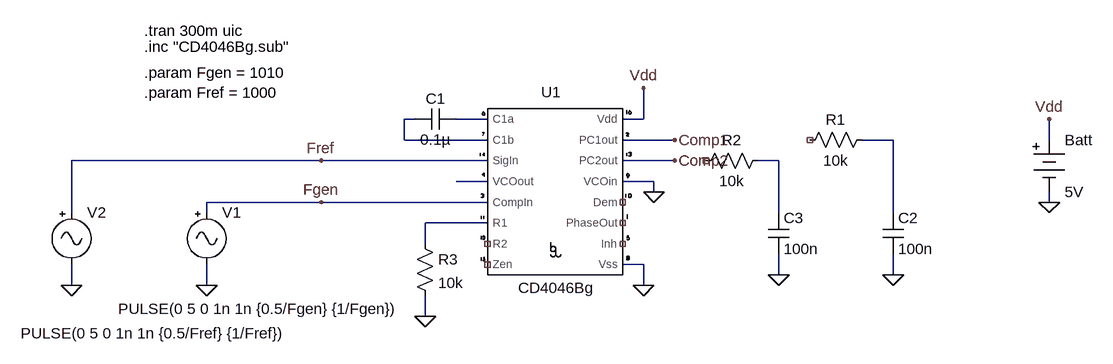
[diagram p0: schematic comparators.asc]
comparators.asc, the LTspice schematic file:
Version 4
SHEET 1 1052 680
WIRE 0 64 -16 64
WIRE 112 64 64 64
WIRE 352 64 352 16
WIRE 352 64 320 64
WIRE -16 96 -16 64
WIRE 112 96 -16 96
WIRE 400 96 320 96
WIRE 736 96 688 96
WIRE 976 96 976 64
WIRE -144 128 -528 128
WIRE 112 128 -144 128
WIRE 400 128 320 128
WIRE 560 128 528 128
WIRE 112 160 64 160
WIRE 368 160 320 160
WIRE 368 176 368 160
WIRE -144 192 -320 192
WIRE 112 192 -144 192
WIRE 976 192 976 176
WIRE -528 208 -528 128
WIRE -320 208 -320 192
WIRE 560 208 560 128
WIRE 736 208 736 96
WIRE 112 224 16 224
WIRE 16 256 16 224
WIRE 352 288 320 288
WIRE 560 304 560 272
WIRE 736 304 736 272
WIRE -528 320 -528 288
WIRE -320 320 -320 288
WIRE 352 320 352 288
WIRE 16 368 16 336
FLAG 976 192 0
FLAG 976 64 Vdd
FLAG 352 320 0
FLAG 352 16 Vdd
FLAG 736 304 0
FLAG 16 368 0
FLAG -320 320 0
FLAG -528 320 0
FLAG -144 128 Fref
FLAG -144 192 Fgen
FLAG 400 96 Comp1
FLAG 400 128 Comp2
FLAG 560 304 0
FLAG 368 176 0
SYMBOL CD4046Bg 224 208 R0
SYMATTR InstName U1
SYMBOL cap 0 80 R270
WINDOW 0 32 32 VTop 2
WINDOW 3 0 32 VBottom 2
SYMATTR InstName C1
SYMATTR Value 0.1µ
SYMBOL Misc\\battery 976 80 R0
WINDOW 123 0 0 Left 2
WINDOW 39 0 0 Left 2
SYMATTR InstName Batt
SYMATTR Value 5V
SYMBOL res 0 240 R0
SYMATTR InstName R3
SYMATTR Value 10k
SYMBOL cap 720 208 R0
SYMATTR InstName C2
SYMATTR Value 100n
SYMBOL res 704 80 R90
WINDOW 0 0 56 VBottom 2
WINDOW 3 32 56 VTop 2
SYMATTR InstName R1
SYMATTR Value 10k
SYMBOL Misc\\signal -320 192 R0
WINDOW 3 -136 164 Left 2
WINDOW 123 0 0 Left 2
WINDOW 39 0 0 Left 2
SYMATTR Value PULSE(0 5 0 1n 1n {0.5/Fgen} {1/Fgen})
SYMATTR InstName V1
SYMBOL Misc\\signal -528 192 R0
WINDOW 3 -78 202 Left 2
WINDOW 123 0 0 Left 2
WINDOW 39 0 0 Left 2
SYMATTR Value PULSE(0 5 0 1n 1n {0.5/Fref} {1/Fref})
SYMATTR InstName V2
SYMBOL res 544 112 R90
WINDOW 0 0 56 VBottom 2
WINDOW 3 32 56 VTop 2
SYMATTR InstName R2
SYMATTR Value 10k
SYMBOL cap 544 208 R0
SYMATTR InstName C3
SYMATTR Value 100n
TEXT -416 -72 Left 2 !.tran 300m uic
TEXT -416 -48 Left 2 !.inc "CD4046Bg.sub"
TEXT -416 -8 Left 2 !.param Fgen = 1010\n.param Fref = 1000

The netlist it stands for:
* comparators.asc
XU1 N002 N001 Fgen NC_01 N006 NC_02 Fref 0 Vdd 0 NC_03 Comp1 Comp2 NC_04 N005 NC_05 CD4046Bg  ; pins C1a C1b CompIn Inh R1 R2 SigIn VCOin Vdd Vss Dem PC1out PC2out PhaseOut VCOout Zen
C1 N001 N002 0.1µ
V§Batt Vdd 0 5V
R3 N006 0 10k
C2 N003 0 100n
R1 N003 NC_06 10k
V1 Fgen 0 PULSE(0 5 0 1n 1n {0.5/Fgen} {1/Fgen})
V2 Fref 0 PULSE(0 5 0 1n 1n {0.5/Fref} {1/Fref})
R2 N004 NC_07 10k
C3 N004 0 100n
.tran 300m uic
.inc "CD4046Bg.sub"
.param Fgen = 1010
.param Fref = 1000
.backanno
.end